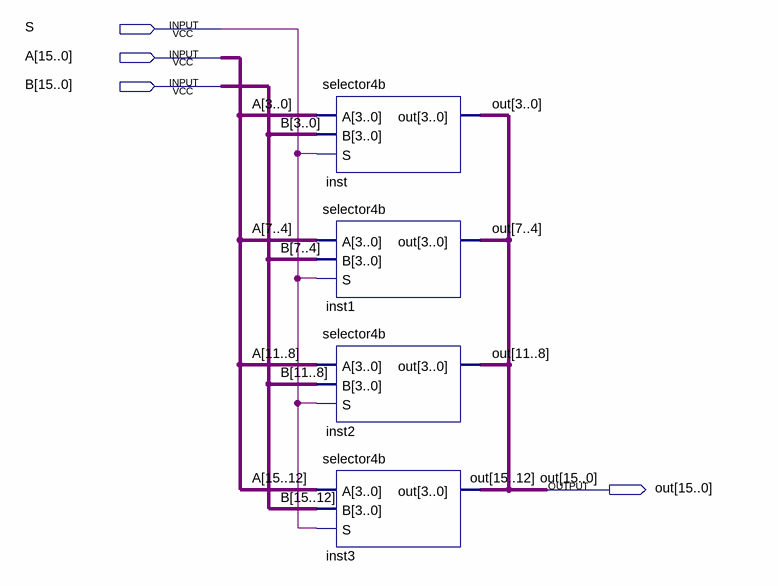
[diagram p0: schematic sheet]
// Quartus schematic selector16b.bdf as structural Verilog: 4 symbols, 4 pins
module selector16b (
  input  S,
  input  [15:0] A,
  input  [15:0] B,
  output [15:0] out
);

  selector4b inst (.A(A[3:0]), .B(B[3:0]), .S(S), .out(out[3:0]));
  selector4b inst1 (.A(A[7:4]), .B(B[7:4]), .S(S), .out(out[7:4]));
  selector4b inst2 (.A(A[11:8]), .B(B[11:8]), .S(S), .out(out[11:8]));
  selector4b inst3 (.A(A[15:12]), .B(B[15:12]), .S(S), .out(out[15:12]));
endmodule
